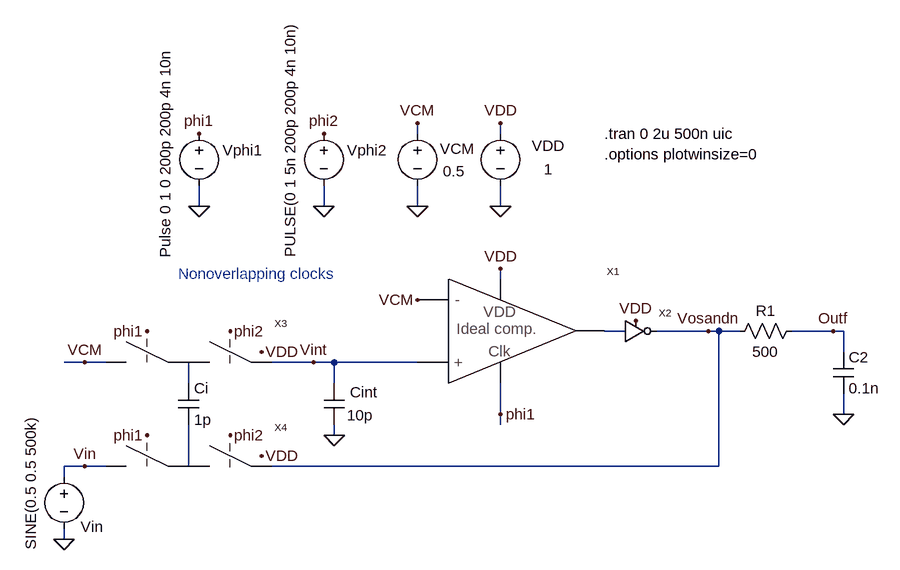
[diagram p0: schematic _Fig6_22_MSD.asc]
_Fig6_22_MSD.asc, the LTspice schematic file:
Version 4
SHEET 1 880 680
WIRE -48 -192 -48 -208
WIRE 80 -192 80 -208
WIRE -384 -80 -384 -112
WIRE -192 -80 -192 -112
WIRE -48 -80 -48 -112
WIRE 80 -80 80 -112
WIRE 80 32 80 16
WIRE 272 112 240 112
WIRE 400 112 320 112
WIRE 416 112 400 112
WIRE 448 112 416 112
WIRE 592 112 528 112
WIRE 608 112 592 112
WIRE 608 144 608 112
WIRE -560 160 -592 160
WIRE -528 160 -560 160
WIRE -208 160 -272 160
WIRE -176 160 -208 160
WIRE -48 160 -176 160
WIRE -400 192 -400 160
WIRE -176 192 -176 160
WIRE 80 240 80 192
WIRE 608 240 608 208
WIRE 80 256 80 240
WIRE -176 272 -176 256
WIRE -560 320 -592 320
WIRE -528 320 -560 320
WIRE -400 320 -400 256
WIRE 416 320 416 112
WIRE 416 320 -272 320
WIRE -592 336 -592 320
WIRE -592 432 -592 416
FLAG 80 -80 0
FLAG 80 16 VDD
FLAG 80 -208 VDD
FLAG -48 -80 0
FLAG -48 -208 VCM
FLAG 400 112 Vosandn
FLAG -176 272 0
FLAG -560 160 VCM
FLAG -208 160 Vint
FLAG 608 240 0
FLAG 592 112 Outf
FLAG -48 64 VCM
FLAG -288 304 VDD
FLAG -288 144 VDD
FLAG -384 -80 0
FLAG -384 -192 phi1
FLAG -192 -80 0
FLAG -192 -192 phi2
FLAG -464 112 phi1
FLAG -336 272 phi2
FLAG -464 272 phi1
FLAG -336 112 phi2
FLAG 80 240 phi1
FLAG -592 432 0
FLAG -560 320 Vin
FLAG 288 96 VDD
SYMBOL Ideal_clocked_comparator 0 112 R0
SYMATTR InstName X1
SYMBOL voltage 80 -208 R0
WINDOW 0 48 35 Left 0
WINDOW 3 67 71 Left 0
SYMATTR InstName VDD
SYMATTR Value 1
SYMBOL voltage -48 -208 R0
WINDOW 0 35 39 Left 0
WINDOW 3 39 74 Left 0
SYMATTR InstName VCM
SYMATTR Value 0.5
SYMBOL cap -192 192 R0
WINDOW 0 40 14 Left 0
WINDOW 3 36 49 Left 0
SYMATTR InstName Cint
SYMATTR Value 10p
SYMBOL res 544 96 R90
WINDOW 0 0 56 VBottom 0
WINDOW 3 32 56 VTop 0
SYMATTR InstName R1
SYMATTR Value 500
SYMBOL cap 592 144 R0
SYMATTR InstName C2
SYMATTR Value 0.1n
SYMBOL switches_2 -528 176 R0
SYMATTR InstName X3
SYMBOL switches_2 -528 336 R0
SYMATTR InstName X4
SYMBOL cap -416 192 R0
SYMATTR InstName Ci
SYMATTR Value 1p
SYMBOL voltage -384 -208 R0
WINDOW 0 36 42 Left 0
WINDOW 3 -52 207 VLeft 0
WINDOW 123 0 0 Left 0
WINDOW 39 0 0 Left 0
SYMATTR InstName Vphi1
SYMATTR Value Pulse 0 1 0 200p 200p 4n 10n
SYMBOL voltage -192 -208 R0
WINDOW 0 36 42 Left 0
WINDOW 3 -52 207 VLeft 0
WINDOW 123 0 0 Left 0
WINDOW 39 0 0 Left 0
SYMATTR InstName Vphi2
SYMATTR Value PULSE(0 1 5n 200p 200p 4n 10n)
SYMBOL voltage -592 320 R0
WINDOW 0 26 93 Left 0
WINDOW 123 0 0 Left 0
WINDOW 39 0 0 Left 0
WINDOW 3 -51 128 VLeft 0
SYMATTR InstName Vin
SYMATTR Value SINE(0.5 0.5 500k)
SYMBOL inverter 272 112 R0
SYMATTR InstName X2
TEXT 240 -192 Left 0 !.tran 0 2u 500n uic
TEXT 240 -160 Left 0 !.options plotwinsize=0
TEXT -416 24 Left 0 ;Nonoverlapping clocks

The netlist it stands for:
* _Fig6_22_MSD.asc
XX1 VCM Vint N001 VDD phi1 Ideal_clocked_comparator  ; pins Vinm Vinp Vout VDD Clock
VDD VDD 0 1
VCM VCM 0 0.5
Cint Vint 0 10p
R1 Outf Vosandn 500
C2 Outf 0 0.1n
XX3 VCM phi1 phi2 Vint VDD N002 switches_2  ; pins P1 clk1 Clk2 P3 VDD P2
XX4 Vin phi1 phi2 Vosandn VDD N003 switches_2  ; pins P1 clk1 Clk2 P3 VDD P2
Ci N002 N003 1p
Vphi1 phi1 0 Pulse 0 1 0 200p 200p 4n 10n
Vphi2 phi2 0 PULSE(0 1 5n 200p 200p 4n 10n)
Vin Vin 0 SINE(0.5 0.5 500k)
XX2 N001 Vosandn VDD inverter  ; pins In Out VDD
.tran 0 2u 500n uic
.options plotwinsize=0
* Nonoverlapping clocks
.backanno
.end